# Altium schematic sheet TrebleBoost.SchDoc
size A4; Author: Jeremiah Lilland; CompanyName: Pinebox Effects; DrawnBy: Jeremiah Lilland; Revision: 1.0
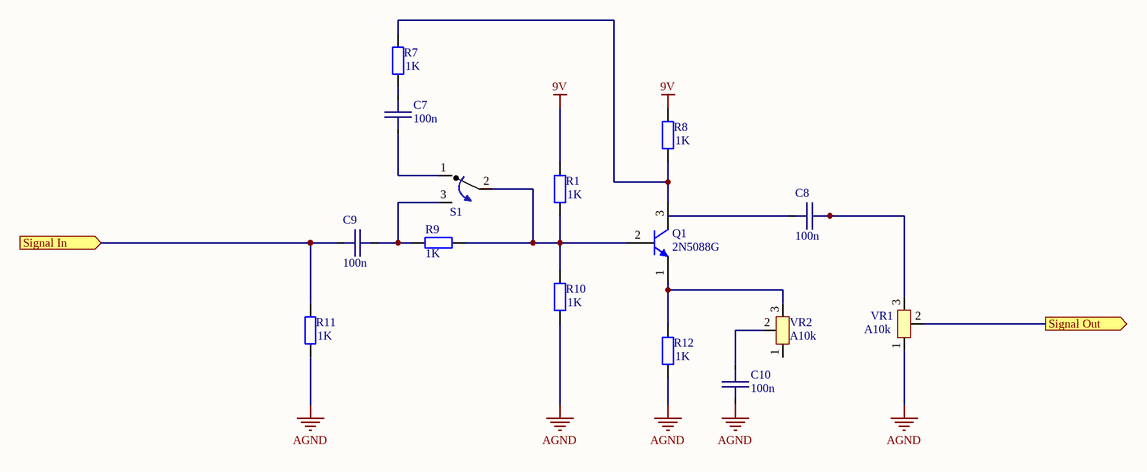
[diagram p0: TrebleBoost.SchDoc]

## Parts
C7  value 100n  [Cap-0.2"]  (hidden comment: Wima Capacitor)
C8  value 100n  [Cap-0.2"]  (hidden comment: Wima Capacitor)
C9  value 100n  [Cap-0.2"]  (hidden comment: Wima Capacitor)
C10  value 100n  [Cap-0.2"]  (hidden comment: Wima Capacitor)
Q1  2N5088G  [ONSC-TO-92-3-29-11]
R1  value 1K  [AXIAL-0.4]  (hidden comment: Res2)
R7  value 1K  [AXIAL-0.4]  (hidden comment: Res2)
R8  value 1K  [AXIAL-0.4]  (hidden comment: Res2)
R9  value 1K  [AXIAL-0.4]  (hidden comment: Res2)
R10  value 1K  [AXIAL-0.4]  (hidden comment: Res2)
R11  value 1K  [AXIAL-0.4]  (hidden comment: Res2)
R12  value 1K  [AXIAL-0.4]  (hidden comment: Res2)
S1  SPDT Toggle  [SPDT Toggle]  (value not drawn)
VR1  value A10k  [Pot-16mm]  (hidden comment: Pot-16mm)
VR2  value A10k  [Pot-16mm]  (hidden comment: Pot-16mm)

## Ports
Signal In (in), Signal Out (out)

## Nets
9V: R1.2 R8.2
AGND: C10.1 R10.1 R11.1 R12.1 VR1.1
Signal In: C9.2 R11.2 ; port Signal In
Signal Out: VR1.2 ; port Signal Out
NetC7_1: C7.1 R7.1
NetC7_2: C7.2 S1.1
NetC8_1: C8.1 VR1.3
NetC9_1: C9.1 R9.2 S1.3
NetC10_2: C10.2 VR2.2
NetQ1_1: Q1.1(E) R12.2 VR2.3
NetQ1_2: Q1.2(B) R1.1 R9.1 R10.2 S1.2
NetQ1_3: Q1.3(C) R7.2 R8.1

Not connected (* = marked no-connect by the designer): C8 2; VR2 1

## Notes on the sheet
- Sheet Title:
- Project Title:
- Date:
- Revision:
- Sheet
- of
- File:

## Library data of the parts
Q1 = 2N5088G: Amplifier Transistor, NPN Silicon, 3-Pin TO-92, Pb-Free, Bulk Box; Manufacturer: On Semiconductor; fT Min (MHz): 50; IC Continuous (A): 0.05; DatasheetVersion: Rev. 4; PackageVersion: Rev. AM; PackageReference: TO-92-3-29-11_AM_SL; PackageDescription: 3-Pin Transistor Outline, Body 4.825 x 3.685 mm, Pitch 1.27 mm; Packing: Bulk Box; Polarity: NPN; RoHS: TRUE; Mounting Technology: Through Hole; PartNumber: 2N5088G; ComponentLink1Description: Manufacturer URL; ComponentLink1URL: http://www.onsemi.com/; ComponentLink2Description: Datasheet; ComponentLink2URL: http://www.onsemi.com/pub_link/Collateral/2N5088-D.PDF; ComponentLink3Description: Package Specification; ComponentLink3URL: http://www.onsemi.cn/pub_link/Collateral/2N6426-D.PDF; Supplier 1: Newark; Supplier Part Number 1: 42K3133; Supplier 2: Mouser; Supplier Part Number 2: 863-2N5088G
R1 R7-R12 = Res2: Resistor; Published: 8-Jun-2000; LatestRevisionDate: 17-Jul-2002; LatestRevisionNote: Re-released for DXP Platform.; PackageReference: AXIAL-0.4; Publisher: Altium Limited; PackageDescription: Axial Device, Thru-Hole; 2 Leads; 0.4 in Pin Spacing